# EAGLE design Gadget-Box-ESP8266-Modules (EAGLE 6.6.0)

## Sheet 1 of 2
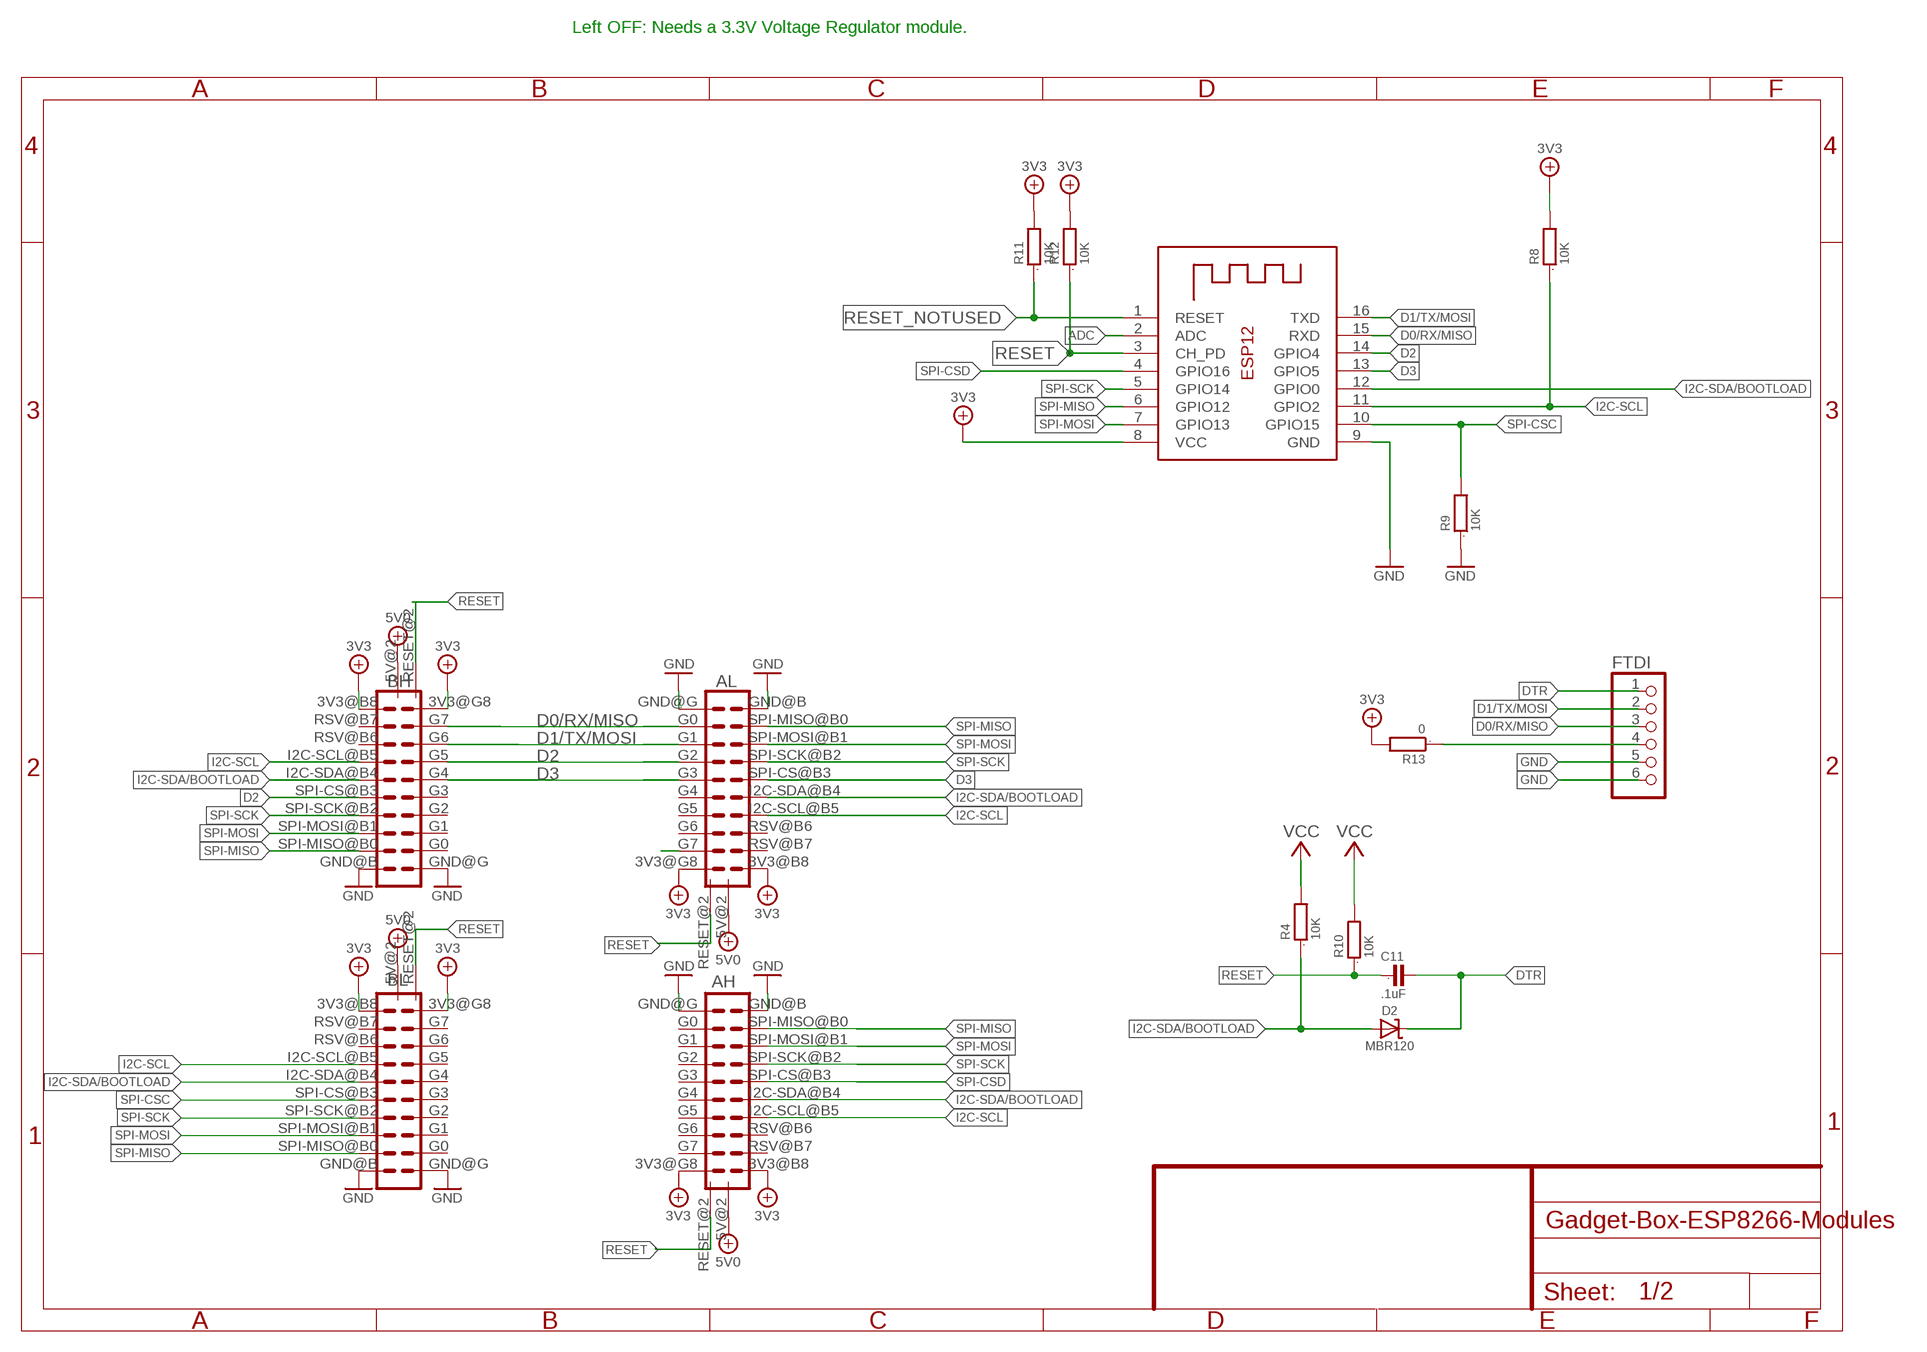
[diagram p0: schematic, sheet 1]

### Parts
AH  ECOGECOG_SLOT_ALT1  [ECOG_ALT1]
AL  ECOGECOG_SLOT_ALT1  [ECOG_ALT1]
BH  ECOGECOG_SLOT_ALT1  [ECOG_ALT1]
BL  ECOGECOG_SLOT_ALT1  [ECOG_ALT1]
C11  .1uF  C0805  [0805]
D2  MBR120  DIODE-SCHOTTKYSOD-123  [SOD-123]
FTDI  PINHD-1X6  [1X06]
R4  10K  R0805  [0805]
R8  10K  R0805  [0805]
R9  10K  R0805  [0805]
R10  10K  R0805  [0805]
R11  10K  R0805  [0805]
R12  10K  R0805  [0805]
R13  0  R0805  [0805]
X2  ESP-12  [ESP-12]

### Nets
3V3: AH.3V3@B8(3V3) AH.3V3@G8(3V3) AL.3V3@B8(3V3) AL.3V3@G8(3V3) BH.3V3@B8(3V3) BH.3V3@G8(3V3) BL.3V3@B8(3V3) BL.3V3@G8(3V3) R8.2 R10.2 R11.2 R12.2 R13.2 X2.8(VCC) ; supply symbol labelled VCC ; also sheet 2
5V0: AH.5V@2(5V) AL.5V@2(5V) BH.5V@2(5V) BL.5V@2(5V)
ADC: X2.2(ADC) ; also sheet 2
D0/RX/MISO: AL.G0 BH.G7 FTDI.3 X2.15(RXD)
D1/TX/MOSI: AL.G1 BH.G6 FTDI.2 X2.16(TXD)
D2: AL.G2 BH.G5 BH.SPI-CS@B3(SPI-CS) X2.14(GPIO4)
D3: AL.G3 AL.SPI-CS@B3(SPI-CS) BH.G4 X2.13(GPIO5)
DTR: C11.2 D2.C FTDI.1
GND [gnd]: AH.GND@B(GND) AH.GND@G(GND) AL.GND@B(GND) AL.GND@G(GND) BH.GND@B(GND) BH.GND@G(GND) BL.GND@B(GND) BL.GND@G(GND) FTDI.5 FTDI.6 R9.1 X2.9(GND) ; also sheet 2
I2C-SCL: AH.I2C-SCL@B5(I2C-SCL) AL.I2C-SCL@B5(I2C-SCL) BH.I2C-SCL@B5(I2C-SCL) BL.I2C-SCL@B5(I2C-SCL) R8.1 X2.11(GPIO2)
I2C-SDA/BOOTLOAD: AH.I2C-SDA@B4(I2C-SDA) AL.I2C-SDA@B4(I2C-SDA) BH.I2C-SDA@B4(I2C-SDA) BL.I2C-SDA@B4(I2C-SDA) D2.A R4.1 X2.12(GPIO0)
N$5: AL.G7
N$6: FTDI.4 R13.1
RESET: AH.RESET@2(RESET) AL.RESET@2(RESET) BH.RESET@2(RESET) BL.RESET@2(RESET) C11.1 R10.1 R12.1 X2.3(CH_PD)
RESET_NOTUSED: R11.1 X2.1(RESET)
SPI-CSC: BL.SPI-CS@B3(SPI-CS) R9.2 X2.10(GPIO15)
SPI-CSD: AH.SPI-CS@B3(SPI-CS) X2.4(GPIO16)
SPI-MISO: AH.SPI-MISO@B0(SPI-MISO) AL.SPI-MISO@B0(SPI-MISO) BH.SPI-MISO@B0(SPI-MISO) BL.SPI-MISO@B0(SPI-MISO) X2.6(GPIO12)
SPI-MOSI: AH.SPI-MOSI@B1(SPI-MOSI) AL.SPI-MOSI@B1(SPI-MOSI) BH.SPI-MOSI@B1(SPI-MOSI) BL.SPI-MOSI@B1(SPI-MOSI) X2.7(GPIO13)
SPI-SCK: AH.SPI-SCK@B2(SPI-SCK) AL.SPI-SCK@B2(SPI-SCK) BH.SPI-SCK@B2(SPI-SCK) BL.SPI-SCK@B2(SPI-SCK) X2.5(GPIO14)
VCC: R4.2
Unconnected: AH.G0 AH.G1 AH.G2 AH.G3 AH.G4 AH.G5 AH.G6 AH.G7 AH.RSV@B6(RSV) AH.RSV@B7(RSV) AL.G4 AL.G5 AL.G6 AL.RSV@B6(RSV) AL.RSV@B7(RSV) BH.G0 BH.G1 BH.G2 BH.G3 BH.RSV@B6(RSV) BH.RSV@B7(RSV) BL.G0 BL.G1 BL.G2 BL.G3 BL.G4 BL.G5 BL.G6 BL.G7 BL.RSV@B6(RSV) BL.RSV@B7(RSV)

### Notes on the sheet
- Left OFF: Needs a 3.3V Voltage Regulator module.

## Sheet 2 of 2
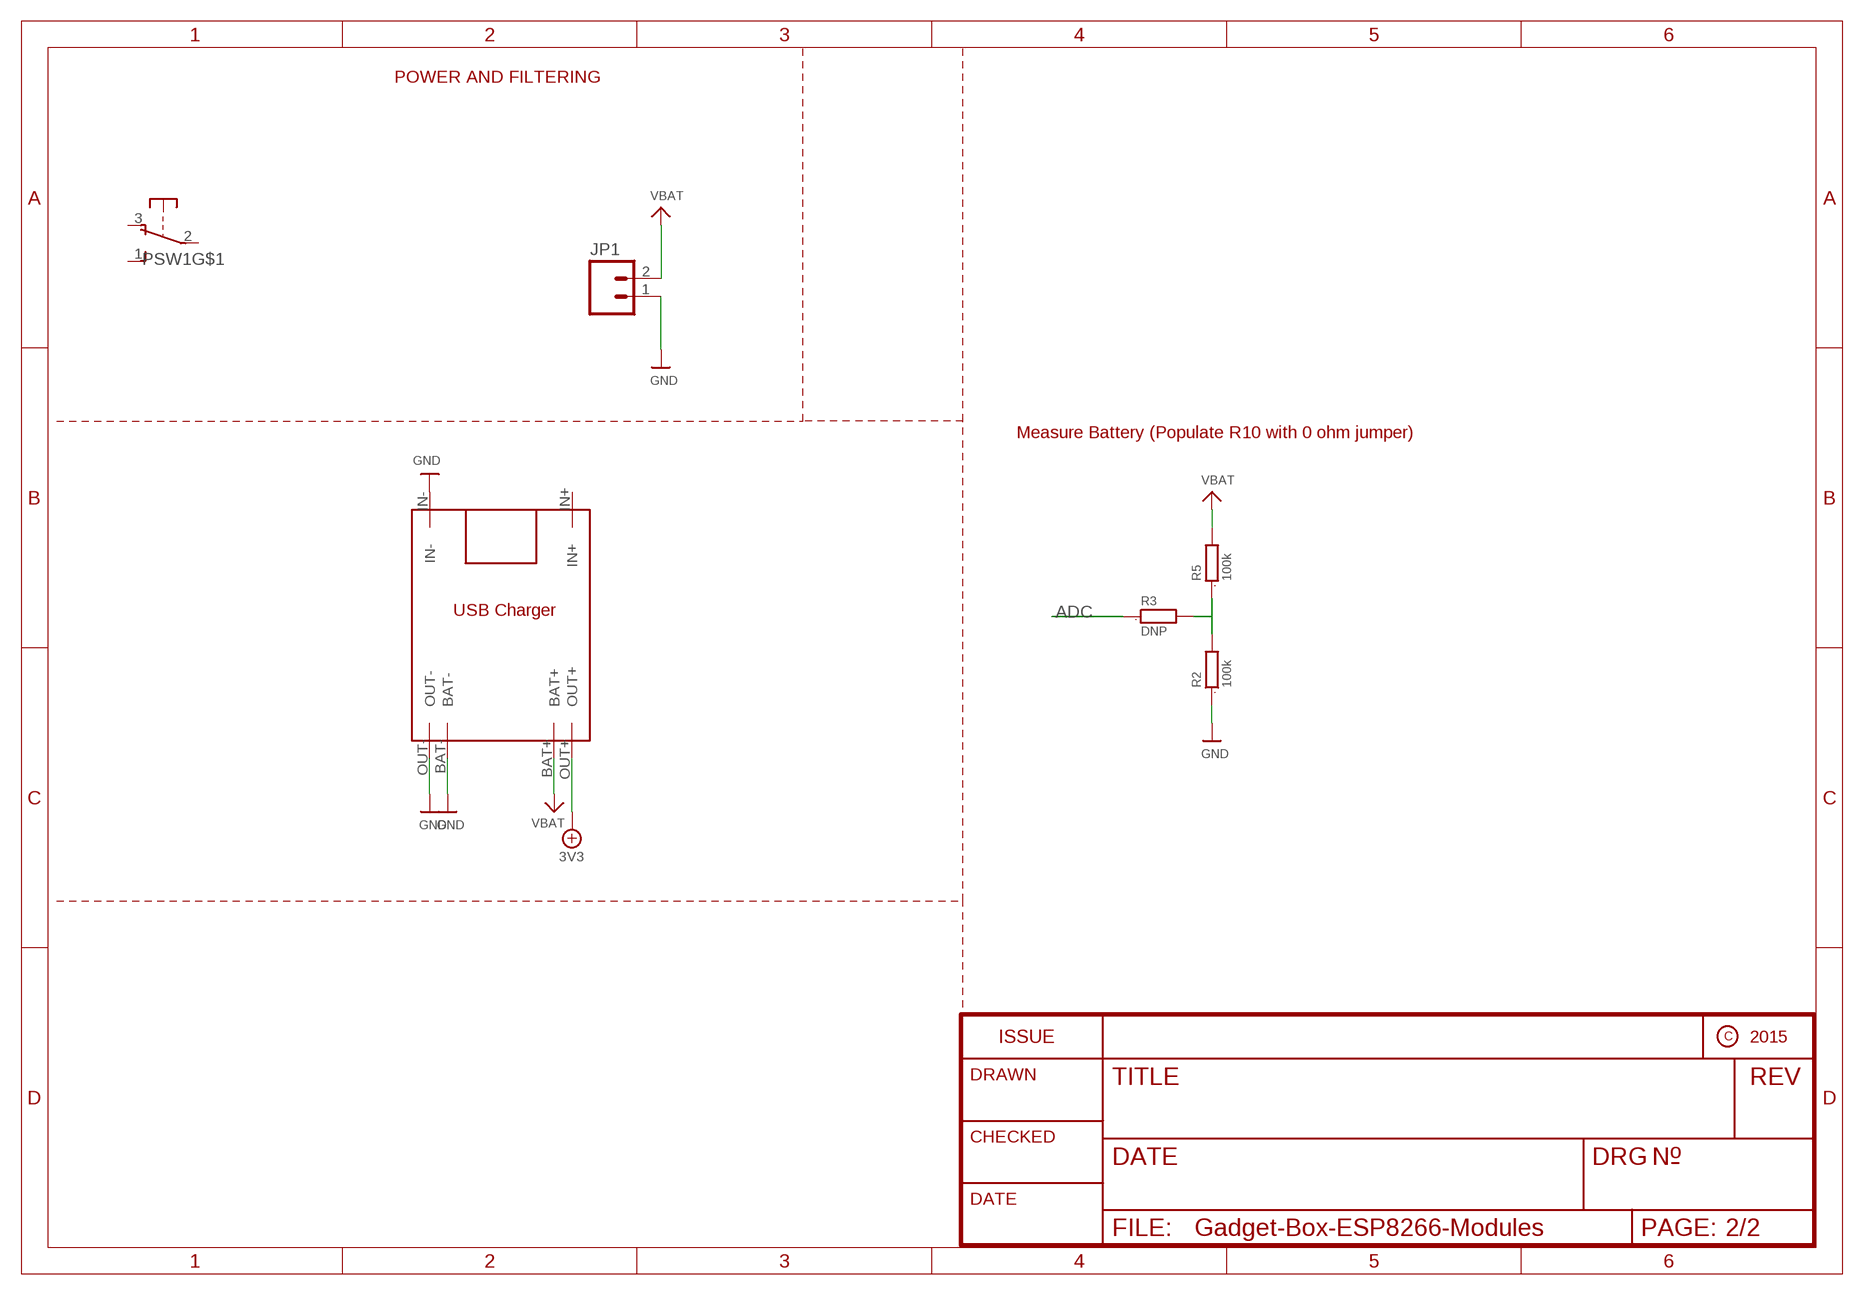
[diagram p1: schematic, sheet 2]

### Parts
JP1  M02-JST-2-PTH-NO_SILK  [JST-2-PTH-NS]
PSW1  OS102011MA1Q  [OS102011MA1Q]
R2  100k  R0603  [0603]
R3  DNP  R0603  [0603]
R5  100k  R0603  [0603]
U$1  TP4056  [TP4056]

### Nets
3V3: U$1.OUT+ ; also sheet 1
ADC: R3.1 ; also sheet 1
GND [gnd]: JP1.1 R2.1 U$1.BAT- U$1.IN- U$1.OUT- ; also sheet 1
N$2: R2.2 R3.2 R5.1
VBAT: JP1.2 R5.2 U$1.BAT+
Unconnected: PSW1.1(S) PSW1.2(P) PSW1.3(O) PSW1.MT1(MT) PSW1.MT2(MT) U$1.IN+

### Notes on the sheet
- POWER AND FILTERING
- Measure Battery (Populate R10 with 0 ohm jumper)

## Library data of the parts
AH AL BH BL = eCogs:ECOG; PARTNO: PPPC102LFBN-RC,SULLINS CONNECTOR SOLUTIONS,dk,S6106-ND,"CONN HEADER FEM 20POS.1"" DL GOLD", REF67
C11 = GadgetFactory:C: CAPACITOR, European symbol; PARTNO: GRM21BR71E104KA01L,MURATA ELECTRONICS (VA),DK,490-1673-1-ND,CAP CER .1UF 25V 10% X7R 0805, REF3
D2 = microbuilder:DIODE-SCHOTTKY; PARTNO: MBR120VLSFT3G,on semiconductor,dk,MBR120VLSFT3GOSCT-ND ,DIODE SCHOTTKY 20V 1A SOD123FL , REF71
FTDI = GadgetFactory:PINHD-1X6: PIN HEADER; PARTNO: PPPC061LGBN-RC,SULLINS CONNECTOR SOLUTIONS,dk,S5481-ND ,"6 Position Header Connector 0.100"" (2.54mm) Through Hole - Right Angle Gold ", REF91
JP1 = SparkFun:M02: Header 2 Standard 2-pin 0.1" header. Use with straight break away headers (SKU : PRT-00116), right angle break away headers (PRT-00553), swiss pins (PRT-00743), machine pins (PRT-00117), and female headers (PRT-00115). Molex polarized connector foot print use with SKU : PRT-08233 with associated crimp pins and housings.; PARTNO: B2B-PH-SM4-TB(LF)(SN),JST SALES AMERICA INC (VA),dk,455-1734-1-ND ,"2 Positions Header, Shrouded Connector 0.079 (2.00mm) Through Hole Tin ", REF87
PSW1 = adafruit:OS102011MA1Q: OS10201MA1Q through-hole right angle switch http://www.ladyada.net/library/eagle; PARTNO: OS102011MA1QN1,C&K Components,dk,CKN9559-ND,SWITCH SLIDE SPDT 100MA 12V , REF72
R2 R5 = GadgetFactory:R: RESISTOR, European symbol; PARTNO: RC0603JR-07100KL,YAGEO (VA),dk,311-100KGRCT-ND,RES SMD 100K OHM 5% 1/10W 0603 , REF76
R3 R13 = GadgetFactory:R: RESISTOR, European symbol; BOM: EXCLUDE
R4 R10 = GadgetFactory:R: RESISTOR, European symbol; PARTNO: RC0805JR-0710KL,YAGEO (VA),dk,311-10KARCT-ND,RES SMD 10K OHM 5% 1/8W 0805, REF63
R8 R9 R11 R12 = GadgetFactory:R: RESISTOR, European symbol; DIGIKEY: RMCF0805JT10K0CT-ND; PARTNO: RC0805JR-0710KL,YAGEO (VA),dk,311-10KARCT-ND,RES SMD 10K OHM 5% 1/8W 0805, REF63
U$1 = TP4056 charging module:TP4056
X2 = adafruit:ESP-12; ADAFRUIT: 2491; PARTNO: 385646,AI-Thinker,dx.com,385646,ESP8266 Serial Wi-Fi Wireless Transceiver Module - http://www.dx.com/p/esp-12e-esp8266-serial-wi-fi-wireless-transceiver-module-for-arduino-rpi-built-in-antenna-385646, REF94

## Net classes
2 gnd: width 0.254 mm, drill 0.381 mm, clearance 0.254 mm
3 usbvcc: width 0.254 mm, drill 0.381 mm, clearance 0.254 mm
4 aref: width 0.254 mm, drill 0.381 mm, clearance 0.254 mm

## Board
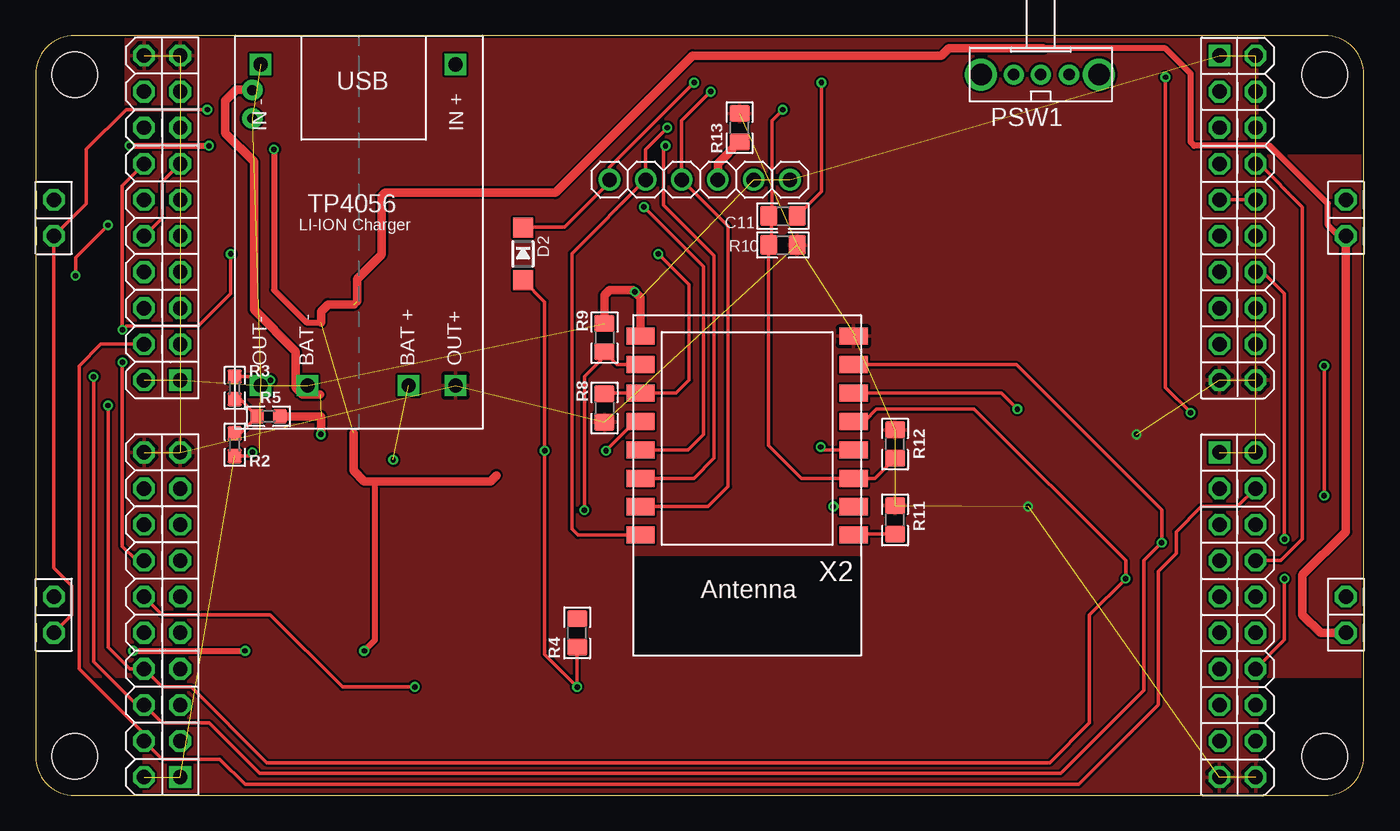
[diagram p2: board, top side]
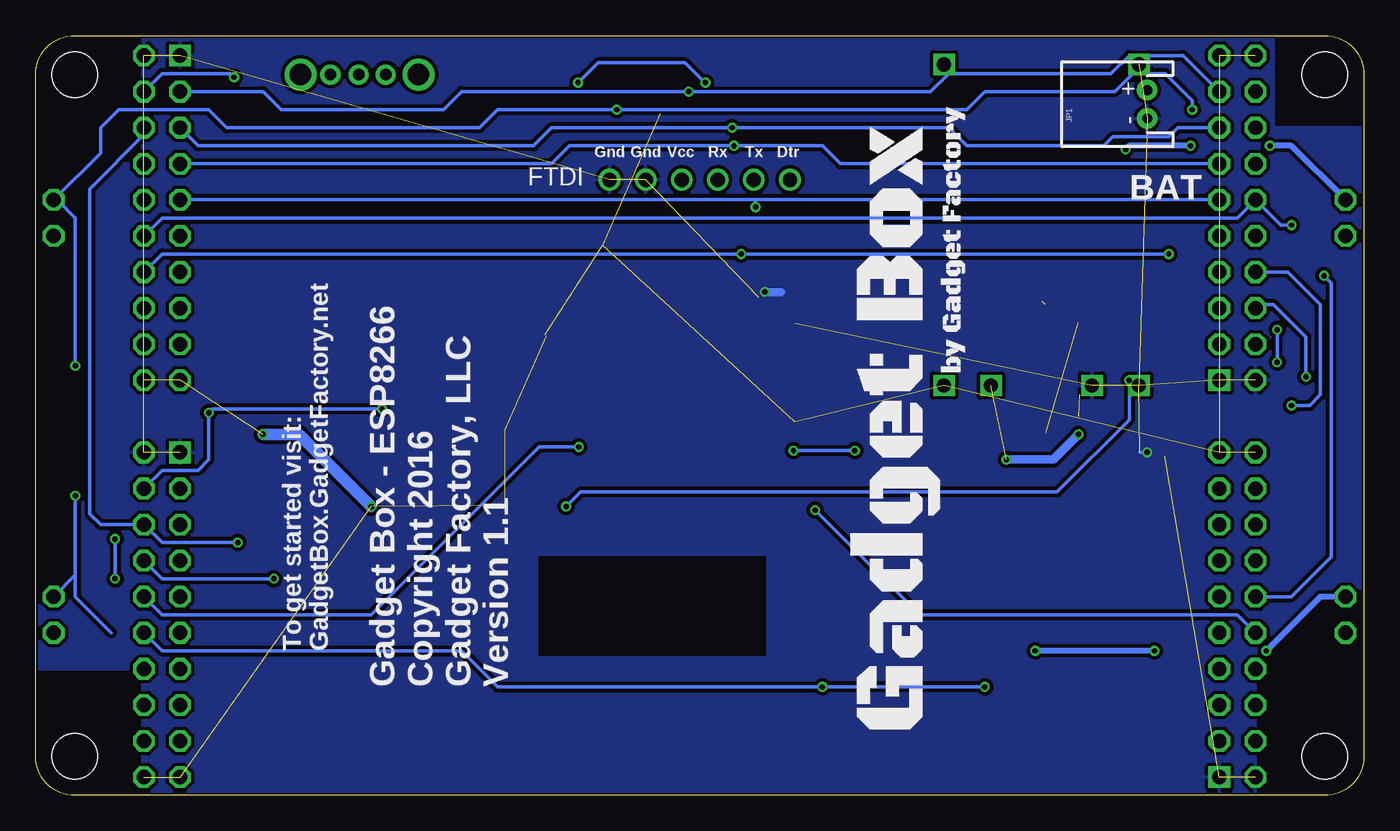
[diagram p3: board, bottom side, seen from below]

Size 93.5 x 53.5 mm. Coordinates in mm from the lower left corner, seen from the top.
Copper layers (1*16): Top 0.035mm / dielectric 1.5mm / Bottom 0.035mm
Design rules "hackvana *": minimum track width 6mil, minimum drill 0.3mm, track to track 6mil, track to pad 6mil, pad to pad 6mil, via to via 6mil, smd to smd 0mil, copper to edge 6mil, drill to drill 6mil, minimum pad ring 10mil, minimum via ring 6mil, stop-mask expansion 2mil, vias tented up to drill 100mil, thermal gap 10mil

### Footprints (pad centres in the part's own frame; a part is rotated, then mirrored left to right if it is on the bottom)
ECOG93P53P5 = hole 3.2: 4,4; 92,4; 92,52; 4,52
ECOG_ALT1 = drill 1.016 octagon: 3V3@B8 21.59,3.81; 3V3@G8 21.59,1.27; 5V@2 11.43,10.16; G0 1.27,1.27; G1 3.81,1.27; G2 6.35,1.27; G3 8.89,1.27; G4 11.43,1.27; G5 13.97,1.27; G6 16.51,1.27; G7 19.05,1.27; GND@B -1.27,3.81; I2C-SCL@B5 13.97,3.81; I2C-SDA@B4 11.43,3.81; RESET@2 8.89,10.16; RSV@B6 16.51,3.81; RSV@B7 19.05,3.81; SPI-CS@B3 8.89,3.81; SPI-MISO@B0 1.27,3.81; SPI-MOSI@B1 3.81,3.81; SPI-SCK@B2 6.35,3.81 | drill 1.016 square: GND@G -1.27,1.27
0805 = smd 1.2 x 1.4: 1 -1,0; 2 1,0
SOD-123 = smd 1.4 x 1.4: A 1.85,0; C -1.85,0
1X06 = drill 1.016: 1 -6.35,0; 2 -3.81,0; 3 -1.27,0; 4 1.27,0; 5 3.81,0; 6 6.35,0
JST-2-PTH-NS = drill 0.7 pad 1.448: 1 -1,0; 2 1,0
OS102011MA1Q = drill 0.8 pad 1.422: 1 -2,0; 2 0,0; 3 1.9,0 | drill 1.5 pad 2.184: MT1 -4.1,0; MT2 4.2,0
0603 = smd 1 x 1: 1 -0.8,0; 2 0.8,0
TP4056 = drill 1 pad 1.422 square: BAT+ 3.505,-8.89; BAT- -3.607,-8.89; IN+ 6.807,13.716; IN- -6.909,13.716; OUT+ 6.807,-8.89; OUT- -6.909,-8.89
ESP-12 = smd 2 x 1.2: 1 -7.5,4.5; 2 -7.5,2.5; 3 -7.5,0.5; 4 -7.5,-1.5; 5 -7.5,-3.5; 6 -7.5,-5.5; 7 -7.5,-7.5; 8 -7.5,-9.5; 9 7.5,-9.5; 10 7.5,-7.5; 11 7.5,-5.5; 12 7.5,-3.5; 13 7.5,-1.5; 14 7.5,0.5; 15 7.5,2.5; 16 7.5,4.5

### Placement (x,y rotation side)
$$U$1  [ECOG93P53P5]  -1.25,-1.25 0 top
AH  82.06,22.88 270 top
AL  82.06,50.82 270 top
BH  11.45,30.5 90 top
BL  11.45,2.56 90 top
C11  52.6,40.79 0 top
D2  34.31,38.12 270 top
FTDI  46.75,43.35 0 top
JP1  15.26,48.66 90 bottom
PSW1  70.75,50.75 180 top
R2  14.02,24.69 90 top
R3  14.02,28.69 270 top
R4  38.12,11.45 90 top
R5  16.4,26.69 0 top
R8  40.05,27.27 270 top
R9  40.05,32.23 270 top
R10  52.6,38.76 0 top
R11  60.49,19.4 90 top
R12  60.49,24.73 90 top
R13  49.55,47.01 90 top
U$1  22.75,37.75 0 top
U$100  [GADGETBOX_TEXT]  32.79,25.93 90 bottom
X2  50.08,22.83 180 top

### Tracks (layer width: path | path; a pad name or v marks a point on that pad's centre or on a via)
3V3  (via drill 0.38)  (15 unrouted)
  Top 0.813: 57.67,32.42 X2.8
  Bottom 0.813: v77.49,25.42 74.95,25.42 v69.87,20.34
  pour Top: -1.25,8.37 -1.25,47.03 6.37,47.03 6.37,54.63 85.95,54.63 85.95,45.01 94.92,45.01 94.92,8.37 85.95,8.37 85.95,-1.25 7.64,-1.25 7.64,8.37
5V0  (via drill 0.38)  (2 unrouted)
  Top 0.406: AL.5V@2 91.71,39.39 90.95,40.15 90.95,41.68 86.89,45.74 81.55,45.74 81.3,45.99 81.3,50.82 79.52,52.6 70.9,52.6 | 23.64,22.12 23.9,21.86 23.9,10.94 v23.13,10.18 | v6.88,10.18 v14.75,10.18 | v16.78,45.49 16.78,35.58 19.07,33.29 20.09,33.29 | v6.62,45.74 v12.21,45.74
  Top 0.61: 32.44,22.53 32.02,22.12 23.64,22.12 23.13,22.12 22.37,22.88 22.37,25.52 | 22.63,34.77 22.63,36.34 24.35,38.07 24.35,42.18 24.6,42.44 36.6,42.44 46.25,52.09 63.77,52.09 64.28,52.6 70.9,52.6 | 20.09,33.29 20.09,34.06 20.59,34.56 22.44,34.56 | AH.5V@2 90.44,11.45 89.17,12.72 89.17,15.51 92.22,18.56 AL.5V@2
  Bottom 0.406: BL.5V@2 3.07,13.99 v6.88,10.18 | v14.75,10.18 v23.13,10.18 | BH.5V@2 5.1,45.74 v6.62,45.74 | v12.21,45.74 16.53,45.74 v16.78,45.49
ADC  (via drill 0.38)
  Top 0.254: R3.1 16.27,29.49 v16.53,29.23 | v56.15,20.34 X2.2
  Bottom 0.254: v16.53,29.23 16.53,26.44 21.61,21.36 55.14,21.36 v56.15,20.34
D0/RX/MISO  (via drill 0.38)
  Top 0.254: v47.52,49.55 45.48,47.51 FTDI.3 48.75,40.08 48.75,21.75 47.33,20.33 X2.15
  Bottom 0.254: AL.G0 77.49,49.55 76.22,48.28 64.79,48.28 63.52,49.55 v47.52,49.55 30.5,49.55 29.23,50.82 17.8,50.82 16.53,52.09 12.72,52.09 BH.G7
D1/TX/MOSI  (via drill 0.38)
  Top 0.254: v44.47,47.01 42.94,45.48 FTDI.2 37.75,38.16 37.75,18.75 38.17,18.33 X2.16
  Bottom 0.254: AL.G1 82.06,45.74 58.44,45.74 57.17,47.01 v44.47,47.01 29.23,47.01 27.96,45.74 18.31,45.74 17.67,46.38 13.74,46.38 13.1,47.01 BH.G6
D2  (via drill 0.38)
  Top 0.254: X2.14 46.33,22.33 47.75,23.75 47.75,38.02 44.22,41.55 44.22,45.61 v44.34,45.74 | BH.SPI-CS@B3 8.91,40.66 8.91,43.2 BH.G5
  Bottom 0.254: AL.G2 57.17,44.47 55.9,45.74 v44.34,45.74 38.12,45.74 36.85,44.47 BH.G5
D3  (via drill 0.38)
  Top 0.254: X2.13 45.92,24.33 47.01,25.42 47.01,37.23 v42.82,41.42 | AL.G3 AL.SPI-CS@B3
  Bottom 0.254: BH.G4 42.82,41.93 | 42.82,41.93 AL.G3 | v42.82,41.42 42.82,41.93
DTR  (via drill 0.38)
  Top 0.254: v46.35,50.19 40.4,44.23 FTDI.1 40.4,43.19 37.23,40.02 34.37,40.02 D2.C | v55.32,50.19 55.32,42.51 C11.2
  Bottom 0.254: v46.35,50.19 46.38,50.19 47.77,51.58 53.92,51.58 v55.32,50.19
GND  (via drill 0.38)  (15 unrouted)
  Top 0.254: R2.1 15,23.89 v15.26,24.15
  Top 0.61: X2.9 42.58,35.06 v42.18,35.45 42.06,35.58 40.41,35.58 40.05,35.22 R9.1
  Bottom 0.254: 15.77,24.15 v15.26,24.15
  Bottom 0.61: v42.18,35.45 41.04,35.45
  pour Bottom: -1.25,8.4 -1.25,47.01 6.37,47.01 6.37,55.14 85.95,55.14 85.95,44.47 94.92,44.47 94.92,8.91 85.95,8.91 85.95,-1.76 7.64,-1.76 7.64,8.4
I2C-SCL  (via drill 0.38)
  Top 0.254: BL.I2C-SCL@B5 7.13,16.53 6.12,17.55 v6.12,30.5 | BH.I2C-SCL@B5 6.12,42.95 v6.12,32.79 6.37,33.04 11.45,33.04 13.74,35.33 v13.74,38.12 | R8.1 40.1,28.33 X2.11 45.09,28.33 45.99,29.23 45.99,35.96 v43.84,38.12 | AL.I2C-SCL@B5 86.38,36.85 87.9,35.33 v87.9,18.05 | v87.9,15.26 87.9,10.94 AH.I2C-SCL@B5
  Bottom 0.254: AL.I2C-SCL@B5 84.6,38.12 v43.84,38.12 v13.74,38.12 | v6.12,30.5 v6.12,32.79 | v87.9,18.05 v87.9,15.26
I2C-SDA/BOOTLOAD  (via drill 0.38)
  Top 0.254: X2.12 42.2,26.33 v40.15,24.28 | v26.69,7.64 21.61,7.64 16.53,12.72 8.91,12.72 BL.I2C-SDA@B4 | v2.81,36.6 2.81,37.87 v5.1,40.15 | D2.A 35.83,34.75 v35.83,24.28 35.83,9.93 v38.12,7.64 R4.1
  Bottom 0.254: v40.15,24.28 v35.83,24.28 | AL.I2C-SDA@B4 84.6,40.66 8.91,40.66 BH.I2C-SDA@B4 5.86,40.15 v5.1,40.15 | BL.I2C-SDA@B4 5.1,13.99 2.31,16.78 2.31,36.09 v2.81,36.6 | AH.I2C-SDA@B4 84.6,10.18 63.52,10.18 60.98,7.64 v38.12,7.64 v26.69,7.64
N$2
  Top 0.254: R3.2 14.4,27.89 R5.1 14.4,25.49 R2.2
N$6
  Top 0.61: FTDI.4 48.02,44.48 R13.1
RESET  (via drill 0.38)
  Top 0.254: v52.6,48.28 51.84,47.52 51.84,41.02 C11.1 51.8,40.59 51.8,38.95 R10.1 51.6,24.64 53.91,22.33 X2.3 59.09,22.33 R12.1 | v90.7,30.25 v90.7,21.1 | BL.RESET@2 2.56,12.72 2.56,14.75 1.29,16.02 BH.RESET@2 3.58,41.68 3.58,45.49 6.37,48.28 v12.09,48.28
  Bottom 0.254: v90.7,30.25 90.7,40.66 91.97,41.93 AL.RESET@2 88.92,45.23 88.92,47.01 87.65,48.28 81.3,48.28 80.03,47.01 62.25,47.01 60.98,48.28 v52.6,48.28 27.96,48.28 26.69,49.55 17.55,49.55 16.28,50.82 13.99,50.82 12.09,48.91 v12.09,48.28 | v90.7,21.1 90.7,15.51 | 90.7,15.51 AH.RESET@2 | 90.7,15.51 90.7,13.99 88.16,11.45
RESET_NOTUSED
  Top 0.254: R11.1 57.65,18.4 X2.1
SPI-CSC  (via drill 0.38)
  Top 0.254: X2.10 40.95,30.33 R9.2 40.05,30.9 38.63,29.48 v38.63,20.09
  Bottom 0.254: BL.SPI-CS@B3 8.91,12.72 31.26,12.72 v38.63,20.09
SPI-CSD  (via drill 0.38)
  Top 0.254: X2.4 55.47,24.33 v55.27,24.53
  Bottom 0.254: v55.27,24.53 58.06,24.53 69.87,12.72 84.6,12.72 AH.SPI-CS@B3
SPI-MISO  (via drill 0.38)
  Top 0.254: AH.SPI-MISO@B0 84.6,20.34 82.06,20.34 80.28,18.56 80.28,17.04 79.01,15.77 79.01,6.37 73.43,0.78 14.75,0.78 12.97,2.56 8.91,2.56 BL.SPI-MISO@B0 7.64,4.34 3.07,8.91 3.07,30.25 4.59,31.77 BH.SPI-MISO@B0 | v79.52,50.57 79.52,28.72 v81.3,26.94 | X2.6 67.98,28.33 v69.11,27.2
  Bottom 0.254: AL.SPI-MISO@B0 84.6,50.82 79.78,50.82 v79.52,50.57 | AH.SPI-MISO@B0 84.6,22.88 82.06,22.88 81.3,23.64 v81.3,26.94 81.05,27.2 v69.11,27.2
SPI-MOSI  (via drill 0.38)
  Top 0.254: v4.08,29.48 4.08,9.42 7.13,6.37 BL.SPI-MOSI@B1 8.91,5.1 12.21,5.1 15.77,1.54 72.16,1.54 78,7.39 78,16.53 v79.27,17.8 79.27,20.09 69.02,30.33 X2.7
  Bottom 0.254: v79.27,17.8 84.6,17.8 AH.SPI-MOSI@B1 88.92,19.07 89.68,19.83 89.68,42.69 85.87,46.5 AL.SPI-MOSI@B1 | v4.08,29.48 4.08,32.28 6.37,34.56 7.39,34.56 BH.SPI-MOSI@B1
SPI-SCK  (via drill 0.38)
  Top 0.254: v5.1,27.45 5.1,10.43 6.62,8.91 BL.SPI-SCK@B2 8.91,7.64 10.94,7.64 16.28,2.31 71.39,2.31 74.19,5.1 74.19,12.72 v76.73,15.26 76.73,16.53 66.06,27.2 59.2,27.2 58.33,26.33 X2.5 | AL.SPI-SCK@B2 86.13,44.47 89.17,41.42 89.17,18.05 87.65,16.53 AH.SPI-SCK@B2
  Bottom 0.254: v76.73,15.26 84.6,15.26 AH.SPI-SCK@B2 | v5.1,27.45 3.83,27.45 3.07,28.21 3.07,34.56 5.35,36.85 BH.SPI-SCK@B2
VBAT  (via drill 0.38)  (2 unrouted)
  Top 0.61: 25.23,23.58 v25.17,23.64 | v20.09,25.42 20.09,26.69 20.08,26.69 R5.2 | 20.03,28.21 18.82,28.21 18.31,28.72 18.31,31.26 15.37,34.2 15.37,44.61 13.36,46.63 13.36,48.91 14.12,49.68 15.24,49.68 JP1.2
  Bottom 0.61: v25.17,23.64 21.86,23.64 v20.09,25.42

### Text on the board
bPlace: Dtr | Tx | Rx | Vcc | Gnd | Gnd | BAT | To get started visit: / GadgetBox.GadgetFactory.net | Gadget Box - ESP8266 / Copyright 2016 / Gadget Factory, LLC / Version 1.1
Reference: TOP Silkscreen is on layer 200